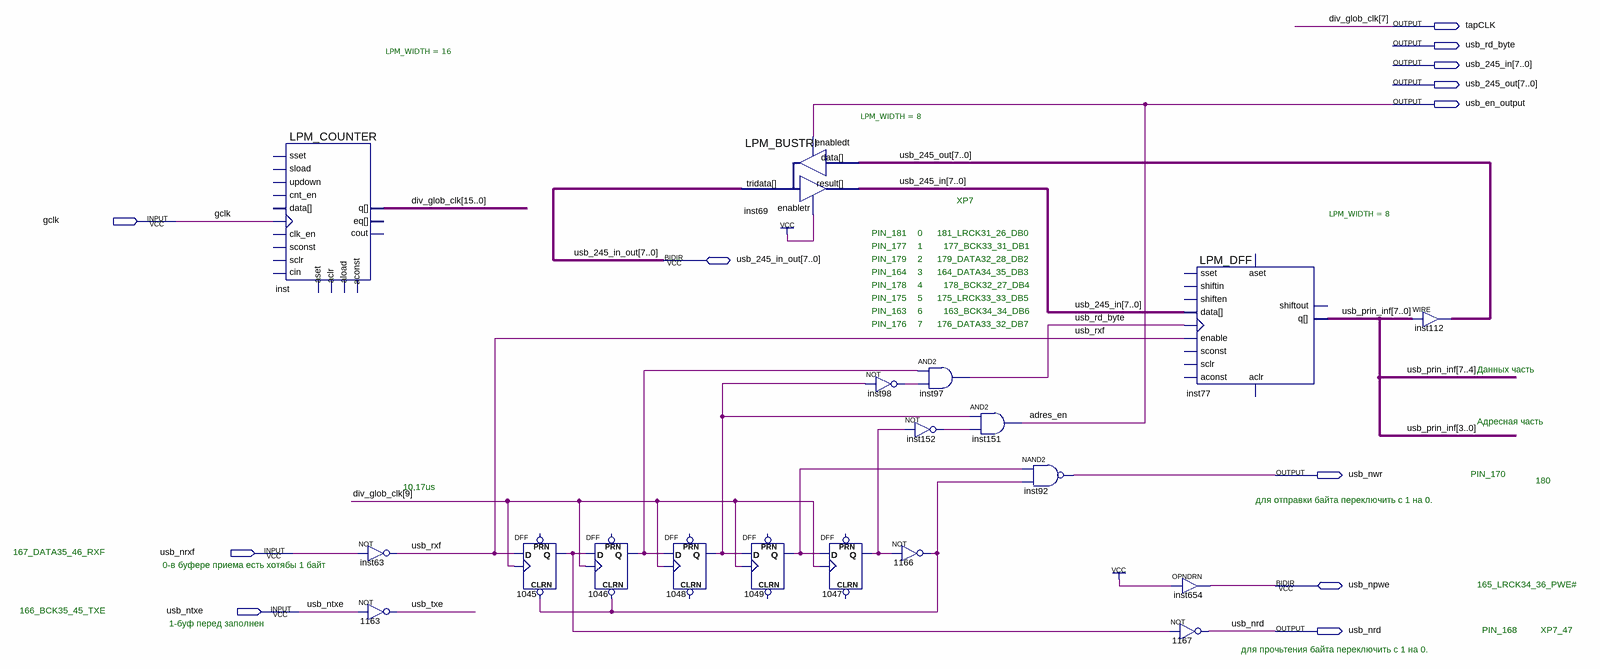
[diagram p0: schematic sheet]
// Quartus schematic sss_FTDI_UM245R.bdf as structural Verilog: 19 symbols, 12 pins
module sss_FTDI_UM245R (
  input  gclk,
  input  usb_nrxf,
  input  usb_ntxe,
  inout  [7:0] usb_245_in_out,
  inout  usb_npwe,
  output tapCLK,
  output usb_rd_byte,
  output [7:0] usb_245_in,
  output [7:0] usb_245_out,
  output usb_en_output,
  output usb_nwr,
  output usb_nrd
);

  wire inst98_out, inst152_out, n1045_q, n1046_q, n1047_q, n1048_q, n1049_q, n1166_out, usb_rxf, usb_txe;
  wire [7:0] usb_prin_inf;
  wire [15:0] div_glob_clk;

  LPM_COUNTER #(.LPM_WIDTH(16)) inst (
    .clock(gclk), .q({div_glob_clk[15:8], tapCLK, div_glob_clk[6:0]}));  // open: sset, sload, updown, cnt_en, data, clk_en, sconst, sclr, aload, aclr, aset, aconst, cin, eq, cout
  not inst63 (usb_rxf, usb_nrxf);
  not u_1163 (usb_txe, usb_ntxe);
  DFF u_1045 (.CLRN(n1166_out), .CLK(div_glob_clk[9]), .D(usb_rxf), .Q(n1045_q));  // open: PRN
  DFF u_1046 (.CLRN(n1166_out), .CLK(div_glob_clk[9]), .D(n1045_q), .Q(n1046_q));  // open: PRN
  DFF u_1048 (.CLK(div_glob_clk[9]), .D(n1046_q), .Q(n1048_q));  // open: CLRN, PRN
  LPM_BUSTRI #(.LPM_WIDTH(8)) inst69 (
    .data(usb_245_out), .enabledt(usb_en_output), .enabletr(1'b1), .result(usb_245_in),
    .tridata(usb_245_in_out));
  DFF u_1049 (.CLK(div_glob_clk[9]), .D(n1048_q), .Q(n1049_q));  // open: CLRN, PRN
  DFF u_1047 (.CLK(div_glob_clk[9]), .D(n1049_q), .Q(n1047_q));  // open: CLRN, PRN
  not inst98 (inst98_out, n1048_q);
  not inst152 (inst152_out, n1047_q);
  not u_1166 (n1166_out, n1047_q);
  and inst97 (usb_rd_byte, n1046_q, inst98_out);
  and inst151 (usb_en_output, n1048_q, inst152_out);
  nand inst92 (usb_nwr, n1049_q, n1166_out);
  OPNDRN inst654 (.IN(1'b1), .OUT(usb_npwe));
  not u_1167 (usb_nrd, n1045_q);
  LPM_DFF #(.LPM_WIDTH(8)) inst77 (
    .enable(usb_rxf), .clock(usb_rd_byte), .data(usb_245_in), .q(usb_prin_inf));  // open: shiftin, shiften, aconst, sclr, sconst, sset, aset, aclr, shiftout
  assign usb_245_out = usb_prin_inf;  // WIRE inst112

  // Other names for the same wires on the sheet: adres_en = usb_en_output; div_glob_clk[7] = tapCLK

  // Notes on the sheet:
  //   XP7
  //   PIN_181
  //   0
  //   181_LRCK31_26_DB0
  //   PIN_177
  //   1
  //   177_BCK33_31_DB1
  //   PIN_179
  //   2
  //   179_DATA32_28_DB2
  //   PIN_164
  //   3
  //   164_DATA34_35_DB3
  //   PIN_178
  //   4
  //   178_BCK32_27_DB4
  //   PIN_175
  //   5
  //   175_LRCK33_33_DB5
  //   PIN_163
  //   6
  //   163_BCK34_34_DB6
  //   PIN_176
  //   7
  //   176_DATA33_32_DB7
  //   Данных часть
  //   Адресная часть
  //   PIN_170
  //   180
  //   10,17us
  //   для отправки байта переключить с 1 на 0.
  //   167_DATA35_46_RXF
  //   0-в буфере приема есть хотябы 1 байт
  //   165_LRCK34_36_PWE#
  //   166_BCK35_45_TXE
  //   1-буф перед заполнен
  //   PIN_168
  //   XP7_47
  //   для прочьтения байта переключить с 1 на 0.
endmodule
